# Altium schematic sheet Sheet3.1_DAC.SchDoc
size A
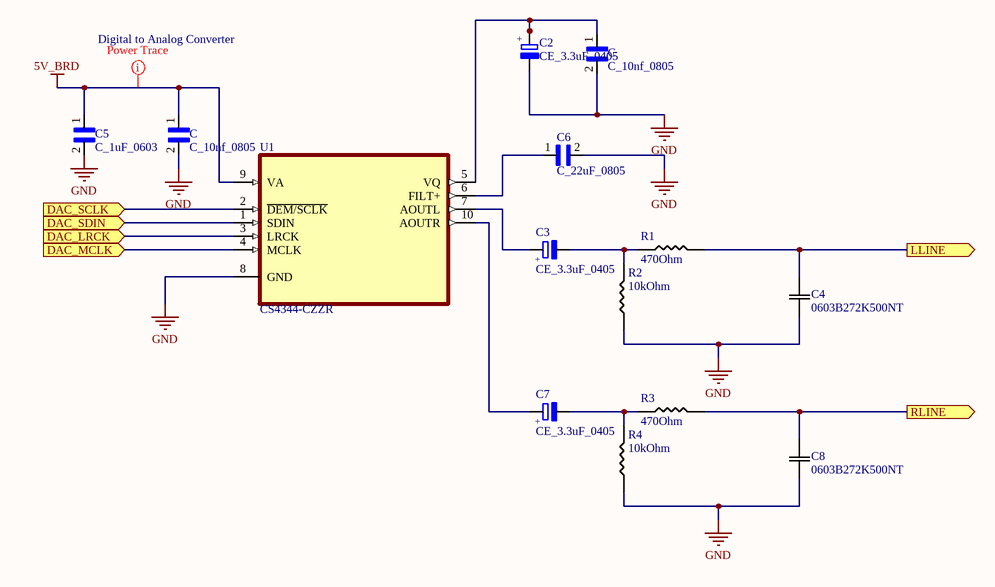
[diagram p0: Sheet3.1_DAC.SchDoc]

## Parts
(Parts that share a designator on the sheet are numbered #1, #2 ... from top to bottom, then left to right.)
C2  CE_3.3uF_0405  [Lelon3.3uf]
C3  CE_3.3uF_0405  [Lelon3.3uf]
C4  0603B272K500NT  [CAP_0603_S_WAL]
C5  C_1uF_0603  [CAPC1608X90N]
C6  C_22uF_0805  [CAPC2012X140N]
C7  CE_3.3uF_0405  [Lelon3.3uf]
C8  0603B272K500NT  [CAP_0603_S_WAL]
C#1  C_10nf_0805  [CAPC2012X140N]
C#2  C_10nf_0805  [CAPC2012X140N]
R1  value 470Ohm  [R0805]  (hidden comment: 470 Ohm)
R2  10kOhm  [R0805]
R3  value 470Ohm  [R0805]  (hidden comment: 470 Ohm)
R4  10kOhm  [R0805]
U1  CS4344-CZZR  [SOP50P490X110-10N]

## Ports
DAC_LRCK (in), DAC_MCLK (in), DAC_SCLK (in), DAC_SDIN (in), LLINE (out), RLINE (out)

## Nets
5V_BRD: C5.1 C#2.1 U1.9(VA)
GND: C2.NEG C4.1 C5.2 C6.2 C8.1 C#1.2 C#2.2 R2.1 R4.1 U1.8(GND)
DAC_LRCK: U1.3(LRCK) ; port DAC_LRCK
DAC_MCLK: U1.4(MCLK) ; port DAC_MCLK
DAC_SCLK: U1.2(~{DEM/SCLK}) ; port DAC_SCLK
DAC_SDIN: U1.1(SDIN) ; port DAC_SDIN
LLINE: C4.2 R1.2 ; port LLINE
RLINE: C8.2 R3.2 ; port RLINE
NetC2_POS: C2.POS C#1.1 U1.5(VQ)
NetC3_NEG: C3.NEG R1.1 R2.2
NetC3_POS: C3.POS U1.7(AOUTL)
NetC6_1: C6.1 U1.6(FILT+)
NetC7_NEG: C7.NEG R3.1 R4.2
NetC7_POS: C7.POS U1.10(AOUTR)

## Layout directives
rule Width Constraint [Pref Width = 13mil    Min Width = 6mil    Max Width = 100mil]: 5V_BRD

## Notes on the sheet
- Digital to Analog Converter
- (in symbol CE_3.3uF_0405) +

## Library data of the parts
C2 C3 C7 = CE_3.3uF_0405: Aluminum Electrolytic Capacitors - SMD; MP: VES3R3M1HTR-0405L; MF: Lelon; Package: None; Availability: Unavailable; Value: *; SnapEDA_Link: https://www.snapeda.com/parts/VZH471M1ETR-1010/Lelon/view-part/2450679/?ref=snap; Price: None; LCSC#: C134505
C4 C8 = C_2.7nf_0603: 10nf 0603 cap; Vendor: FH; Value: 2.7nf; Manufacturer_Part_Number: 0603B272K500NT; LCSC#: C1609; Package: 0603
C5 = C_1uF_0603: 1uF ±10% 50V Ceramic Capacitor X7R 0603 (1608 Metric); MP: CL10A105KB8NNNC; MF: Samsung; Price: None; SnapEDA_Link: https://www.snapeda.com/parts/CL10B102KB8NNNC/Samsung/view-part/544114/?ref=snap; Availability: Good; Package: 0603 Samsung; Value: 1uF; LCSC#: c15849
C6 = C_22uF_0805: 22µF 0805 ±20% 25V Ceramic Capacitor X5R 0805 (2012 Metric); MF: Samsung; MP: CL21A226MAQNNNE; SnapEDA_Link: https://www.snapeda.com/parts/CL21A226MAQNNNE/Samsung%20Electro-Mechanics/view-part/620487/?ref=snap; Check_prices: https://www.snapeda.com/parts/CL21A226MAQNNNE/Samsung%20Electro-Mechanics/view-part/620487/?ref=eda; Digi-Key_Part_Number: 1276-2908-1-ND; Value: *; Package: 0805 Samsung; Purchase-URL: https://pricing.snapeda.com/search/part/CL21A226MAQNNNE/?ref=eda; LCSC#: C45783
C#1 C#2 = C_10nf_0805: CL21B103KBANNNC    10000pF Â±10% 50V Ceramic Capacitor X7R 0805 (2012 Metric); MF: Samsung; Value: 10nf; Digi-Key_Part_Number: 1276-1015-1-ND; SnapEDA_Link: https://www.snapeda.com/parts/CL21B103KBANNNC/Samsung%20Electro-Mechanics/view-part/46816/?ref=snap; LCSC#: C1710; DigiKey-Purchase-URL: https://snapeda.com/shop?store=DigiKey&id=46816; Package: 0805 Samsung; MP: CL21B103KBANNNC
R1 R3 = R_470Ohm_0805: 470Ohm +-1%; MFR: Uniroyal; Mfr#: 0805W8F4700T5E; LCSC#: C17710
R2 R4 = R_10kOhm_0805: 10kOhm +-1%  0805; MFR: Uniroyal; Mfr#: 0805W8F1002T5E; LCSC#: C17414; Value: 10kOhm
U1 = CS4344-CZZR: DAC, Audio 24 b 192k IÂ²S 10-SSOP; MF: Cirrus Logic; Package: TSSOP-10 Cirrus Logic; JLC PartNum: C8952; SnapEDA_Link: https://www.snapeda.com/parts/CS4344-CZZR/Cirrus%20Logic%20Inc./view-part/33568/?ref=snap; Value: *; MP: CS4344-CZZR; Availability: Unavailable